# Altium project LoraNode.PrjPcb
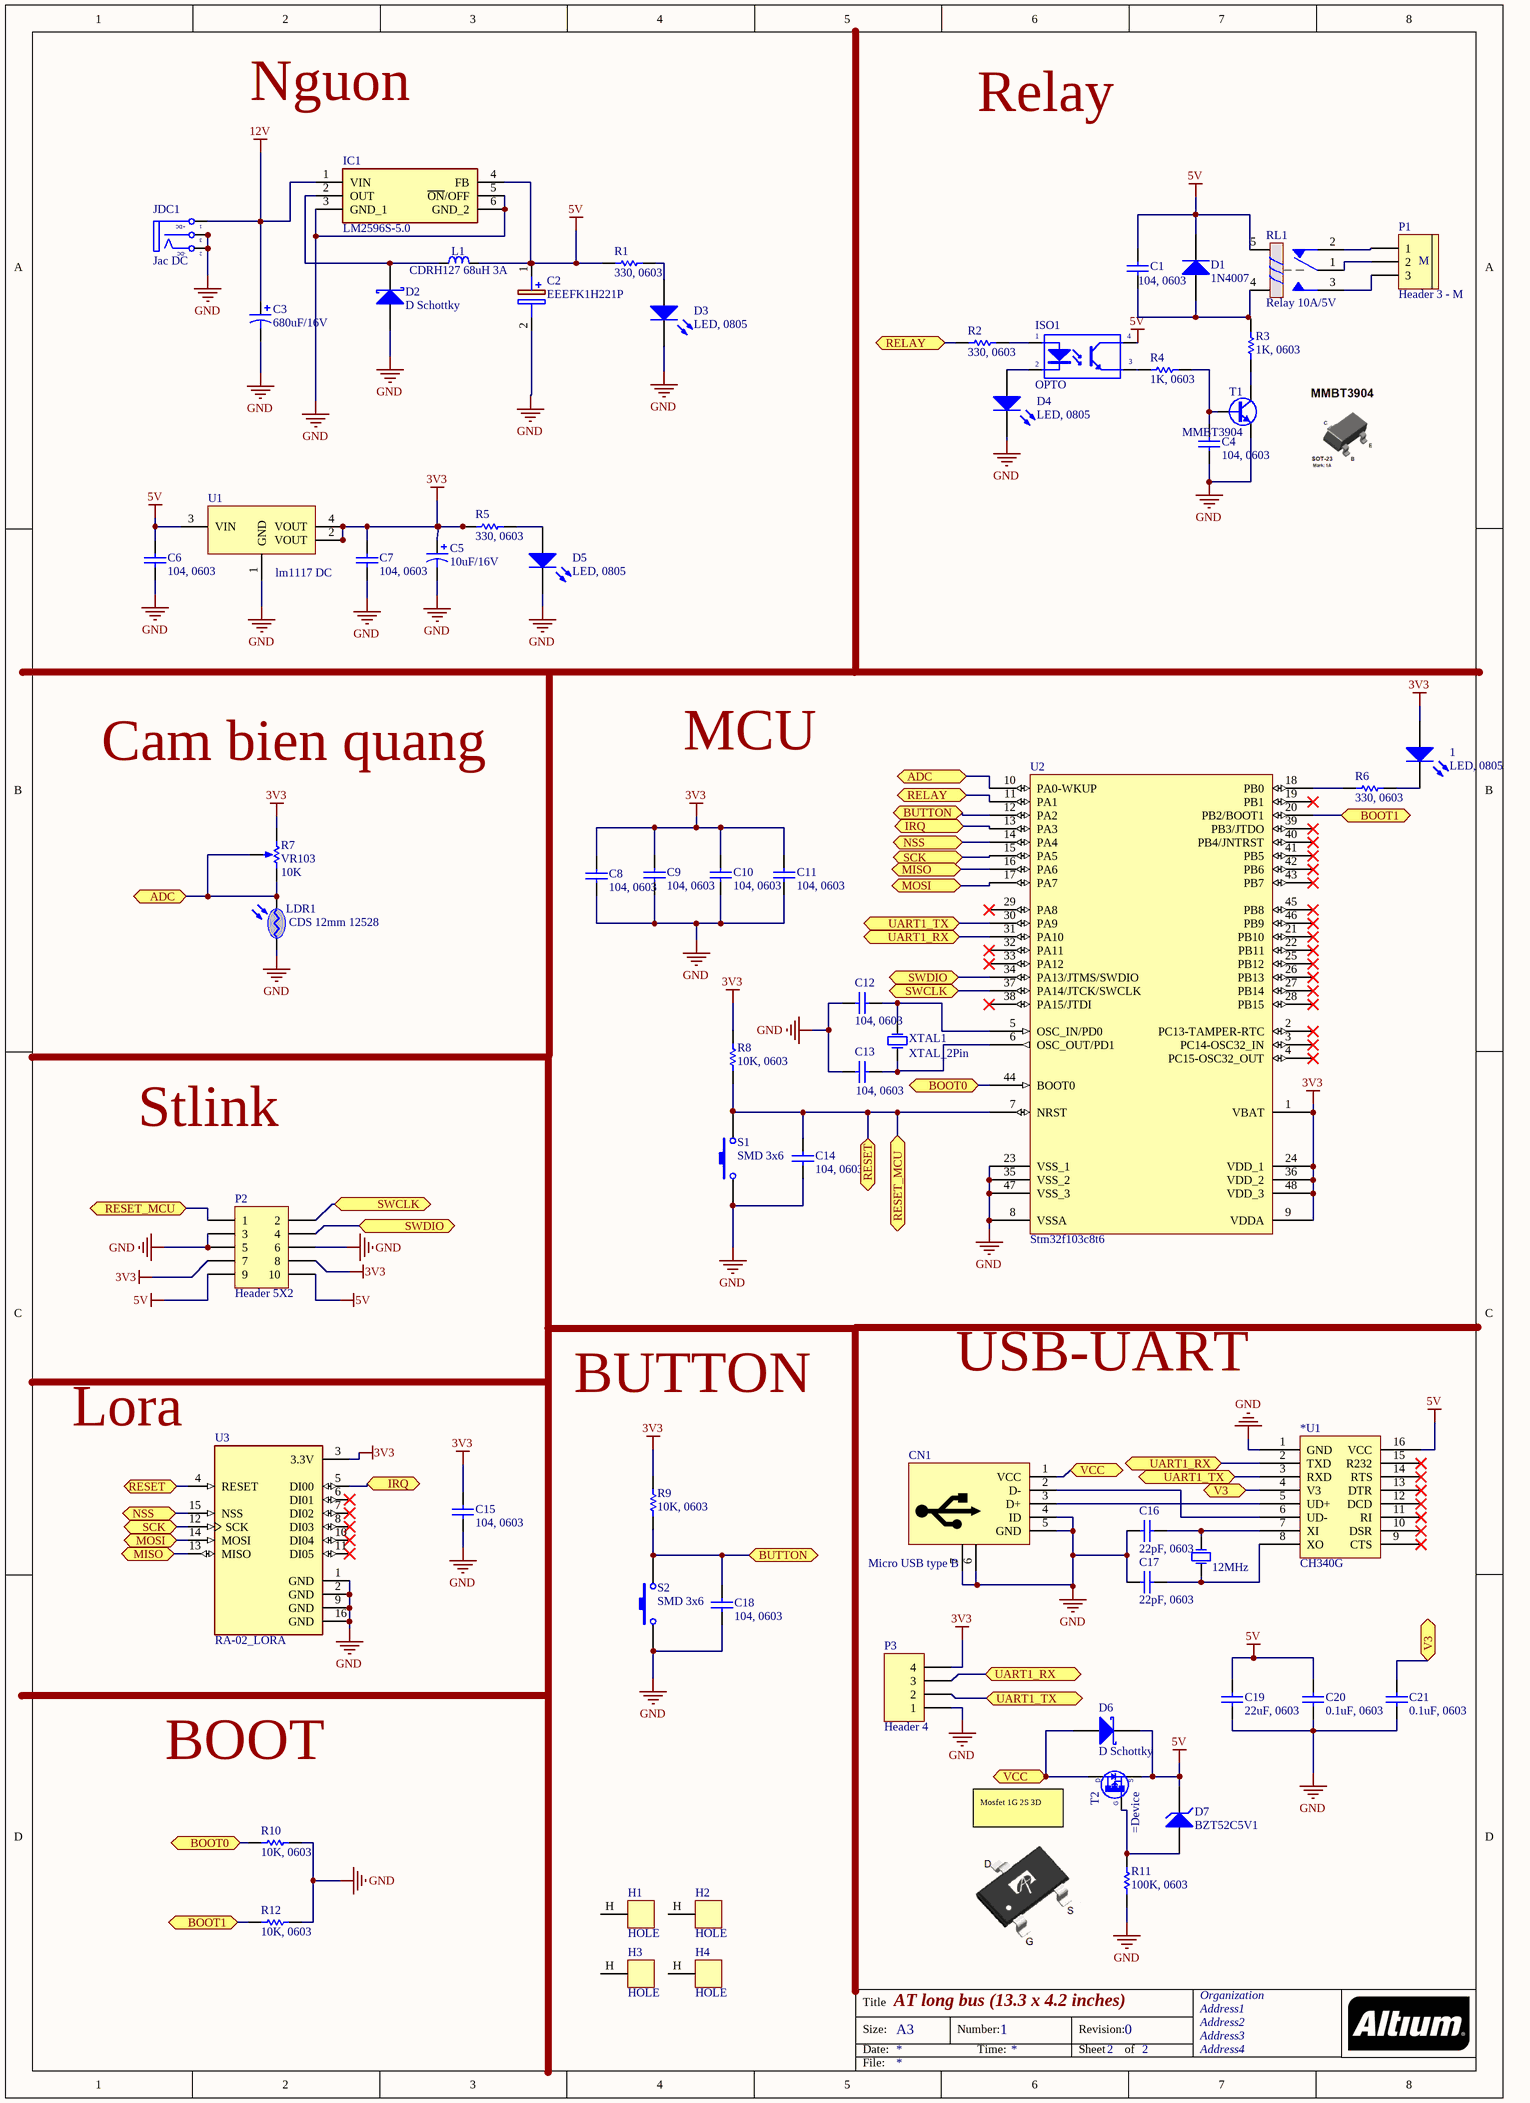
[diagram p0: LoraNode.schdoc]
1 sheet, 65 parts. Net scope: flat (ports and power ports of the same name join across sheets).
Board file: LoraNode.PcbDoc

## Sheet LoraNode.schdoc: AT long bus (13.3 x 4.2 inches)
size A3 portrait; Organization: Organization; Address1: Address1; Address2: Address2; Address3: Address3; Address4: Address4; DocumentNumber: 1; Revision: 0; SheetNumber: 2; SheetTotal: 2

### Parts
1  LED, 0805  [LED0805]
*U1  CH340G  [SOIC127P680X230-16N]
C1  value 104, 0603  [0603 CAP]  (hidden comment: Cap)
C2  EEEFK1H221P  [CAPAE1030X1080N]
C3  value 680uF/16V  [Cap SMD 10x10x10,5]  (hidden comment: Cap Pol2)
C4  value 104, 0603  [0603 CAP]  (hidden comment: Cap)
C5  value 10uF/16V  [Cap size B]  (hidden comment: Cap Pol2)
C6  value 104, 0603  [0603 CAP]  (hidden comment: Cap)
C7  value 104, 0603  [0603 CAP]  (hidden comment: Cap)
C8  value 104, 0603  [0603 CAP]  (hidden comment: Cap)
C9  value 104, 0603  [0603 CAP]  (hidden comment: Cap)
C10  value 104, 0603  [0603 CAP]  (hidden comment: Cap)
C11  value 104, 0603  [0603 CAP]  (hidden comment: Cap)
C12  value 104, 0603  [0603 CAP]  (hidden comment: Cap)
C13  value 104, 0603  [0603 CAP]  (hidden comment: Cap)
C14  value 104, 0603  [0603 CAP]  (hidden comment: Cap)
C15  value 104, 0603  [0603 CAP]  (hidden comment: Cap)
C16  value 22pF, 0603  [0603 CAP]  (hidden comment: Cap)
C17  value 22pF, 0603  [0603 CAP]  (hidden comment: Cap)
C18  value 104, 0603  [0603 CAP]  (hidden comment: Cap)
C19  value 22uF, 0603  [0603 CAP]  (hidden comment: Cap)
C20  value 0.1uF, 0603  [0603 CAP]  (hidden comment: Cap)
C21  value 0.1uF, 0603  [0603 CAP]  (hidden comment: Cap)
CN1  Micro USB type B  [USB-B-Micro-Hole]
D1  1N4007  [DO 214]
D2  D Schottky  [DO-214AC]
D3  LED, 0805  [LED0805]
D4  LED, 0805  [LED0805]
D5  LED, 0805  [LED0805]
D6  D Schottky  [DO-214AC]
D7  BZT52C5V1  [DO 214]
H1  HOLE  [HOLE]
H2  HOLE  [HOLE]
H3  HOLE  [HOLE]
H4  HOLE  [HOLE]
IC1  LM2596S-5.0  [KTT0005B]
ISO1  OPTO  [PC817 SMD]
JDC1  Jac DC  [DC-IN]
L1  CDRH127 68uH 3A  [IND_BOURNS_SRR1260]
LDR1  CDS 12mm 12528  [CDS]
P1  Header 3 - M  [Medium - Header 3]
P2  Header 5X2  [HDR2X5]
P3  Header 4  [HDR1X4]
R1  value 330, 0603  [0603 RESISTOR]  (hidden comment: Resistor)
R2  value 330, 0603  [0603 RESISTOR]  (hidden comment: Resistor)
R3  value 1K, 0603  [0603 RESISTOR]  (hidden comment: Resistor)
R4  value 1K, 0603  [0603 RESISTOR]  (hidden comment: Resistor)
R5  value 330, 0603  [0603 RESISTOR]  (hidden comment: Resistor)
R6  value 330, 0603  [0603 RESISTOR]  (hidden comment: Resistor)
R7  VR103  value 10K  [VR]
R8  value 10K, 0603  [0603 RESISTOR]  (hidden comment: Resistor)
R9  value 10K, 0603  [0603 RESISTOR]  (hidden comment: Resistor)
R10  value 10K, 0603  [0603 RESISTOR]  (hidden comment: Resistor)
R11  value 100K, 0603  [0603 RESISTOR]  (hidden comment: Resistor)
R12  value 10K, 0603  [0603 RESISTOR]  (hidden comment: Resistor)
RL1  Relay 10A/5V  [RL_SPDT_10A]
S1  SMD 3x6  [SW-SMD]
S2  SMD 3x6  [SW-SMD]
T1  MMBT3904  [SOT23 - 3PIN]
T2  (no value)  [SOT23 - 3PIN]
U1  lm1117 DC  [SOT230P700X175-4N]
U2  Stm32f103c8t6  [LQFP 48 PIN]
U3  RA-02_LORA  [MODULE_RA-02_LORA]
XTAL1  XTAL_2Pin  [XTAL_HC-49/U]
Y1  12MHz  [XTAL_CITIZEN_HCM49]

### Ports
ADC (bidir), BOOT0 (bidir), BOOT1 (bidir), BUTTON (bidir), IRQ (bidir), MISO (bidir), MOSI (bidir), NSS (bidir), RELAY (bidir), RESET (bidir), RESET_MCU (bidir), SCK (bidir), SWCLK (bidir), SWDIO (bidir), UART1_RX (bidir), UART1_TX (bidir), V3 (bidir), VCC (bidir)

### Nets
3V3: 1.1(A) C5.1 C7.2 C8.2 C9.2 C10.2 C11.2 C15.2 P2.7 P2.8 P3.4 R5.2 R7.1(TOP) R8.2 R9.2 U1.2(VOUT) U1.4(VOUT) U2.1(VBAT) U2.9(VDDA) U2.24(VDD_1) U2.36(VDD_2) U2.48(VDD_3) U3.3(3.3V)
5V: *U1.16(VCC) C1.2 C2.1(+) C6.2 C19.1 C20.1 D1.2(K) D6.2(K) D7.2(K) IC1.4(FB) ISO1.4(C) L1.2 P2.9 P2.10 R1.2 RL1.5 T2.2(S) U1.3(VIN)
12V: C3.1 IC1.1(VIN) JDC1.1(T)
GND: *U1.1(GND) C2.2(-) C3.2 C4.1 C5.2 C6.1 C7.1 C8.1 C9.1 C10.1 C11.1 C12.2 C13.2 C14.1 C15.1 C16.2 C17.2 C18.1 C19.2 C20.2 C21.2 CN1.4(ID) CN1.5(GND) CN1.6(GND) CN1.7(GND) D2.1(A) D3.2(K) D4.2(K) D5.2(K) IC1.3(GND_1) IC1.5(~{ON}/OFF) IC1.6(GND_2) JDC1.2(TN) JDC1.3(S) LDR1.1(A) P2.3 P2.5 P2.6 P3.1 R10.1 R11.2 R12.1 S1.1 S2.1 T1.2(E) U1.1(GND) U2.8(VSSA) U2.23(VSS_1) U2.35(VSS_2) U2.47(VSS_3) U3.1(GND) U3.2(GND) U3.9(GND) U3.16(GND)
Net1_2: 1.2(K) R6.2
Net*U1_2: *U1.2(TXD) P3.3 U2.31(PA10) ; port UART1_RX
Net*U1_3: *U1.3(RXD) P3.2 U2.30(PA9) ; port UART1_TX
Net*U1_4: *U1.4(V3) C21.1 ; port V3
Net*U1_5: *U1.5(UD+) CN1.3(D+)
Net*U1_6: *U1.6(UD-) CN1.2(D-)
Net*U1_7: *U1.7(XI) C16.1 Y1.2(OSC2)
Net*U1_8: *U1.8(XO) C17.1 Y1.1(OSC1)
NetC1_1: C1.1 D1.1(A) R3.1 RL1.4
NetC4_2: C4.2 R4.1 T1.1(B)
NetC12_1: C12.1 U2.5(OSC_IN/PD0) XTAL1.2(OSC2)
NetC13_1: C13.1 U2.6(OSC_OUT/PD1) XTAL1.1(OSC1)
NetC14_2: C14.2 P2.1 R8.1 S1.2 U2.7(NRST) U3.4(RESET) ; port RESET_MCU, port RESET
NetC18_2: C18.2 R9.1 S2.2 U2.12(PA2) ; port BUTTON
NetCN1_1: CN1.1(VCC) D6.1(A) T2.3(D) ; port VCC
NetD2_2: D2.2(K) IC1.2(OUT) L1.1
NetD3_1: D3.1(A) R1.1
NetD4_1: D4.1(A) ISO1.2(K)
NetD5_1: D5.1(A) R5.1
NetD7_1: D7.1(A) R11.1 T2.1(G)
NetISO1_1: ISO1.1(A) R2.1
NetISO1_3: ISO1.3(E) R4.2
NetLDR1_2: LDR1.2(K) R7.2(TAP) R7.3(BOT) U2.10(PA0-WKUP) ; port ADC
NetP1_1: P1.1 RL1.2
NetP1_2: P1.2 RL1.1
NetP1_3: P1.3 RL1.3
NetP2_2: P2.2 U2.37(PA14/JTCK/SWCLK) ; port SWCLK
NetP2_4: P2.4 U2.34(PA13/JTMS/SWDIO) ; port SWDIO
NetR2_2: R2.2 U2.11(PA1) ; port RELAY
NetR3_2: R3.2 T1.3(C)
NetR6_1: R6.1 U2.18(PB0)
NetR10_2: R10.2 U2.44(BOOT0) ; port BOOT0
NetR12_2: R12.2 U2.20(PB2/BOOT1) ; port BOOT1
NetU2_13: U2.13(PA3) U3.5(DI00) ; port IRQ
NetU2_14: U2.14(PA4) U3.15(NSS) ; port NSS
NetU2_15: U2.15(PA5) U3.12(SCK) ; port SCK
NetU2_16: U2.16(PA6) U3.13(MISO) ; port MISO
NetU2_17: U2.17(PA7) U3.14(MOSI) ; port MOSI

Not connected (* = marked no-connect by the designer): *U1 9(CTS)* 10(DSR)* 11(RI)* 12(DCD)* 13(DTR)* 14(RTS)* 15(R232)*; H1 H(HOLE); H2 H(HOLE); H3 H(HOLE); H4 H(HOLE); U2 2(PC13-TAMPER-RTC)* 3(PC14-OSC32_IN)* 4(PC15-OSC32_OUT)* 19(PB1)* 21(PB10)* 22(PB11)* 25(PB12)* 26(PB13)* 27(PB14)* 28(PB15)* 29(PA8)* 32(PA11)* 33(PA12)* 38(PA15/JTDI)* 39(PB3/JTDO)* 40(PB4/JNTRST)* 41(PB5)* 42(PB6)* 43(PB7)* 45(PB8)* 46(PB9)*; U3 6(DI01)* 7(DI02)* 8(DI03)* 10(DI04)* 11(DI05)*

### Notes on the sheet
- Nguon
- Relay
- Cam bien quang
- MCU
- Stlink
- USB-UART
- (near U3) Lora
- BUTTON
- BOOT
- (near T2) Mosfet 1G 2S 3D
- Title
- Size:
- Date:
- A3
- Number:
- Time:
- Revision:
- Sheet
- of
- File:
- (in symbol DCIN) +DC; -DC
- (in symbol Header 3 - M) M

### Library data of the parts
1 D3-D5 = LED: Typical INFRARED GaAs LED; Published: 8-Jun-2000; LatestRevisionDate: 08-Jul-2005; LatestRevisionNote: Mech Layer 1 removed.; PackageReference: LED-0; Publisher: Altium Limited
C1 C4 C6-C21 = Cap: Capacitor; Published: 8-Jun-2000; LatestRevisionDate: 17-Jul-2002; LatestRevisionNote: Re-released for DXP Platform.; PackageReference: RAD-0.3; Publisher: Altium Limited
C2 = EEEFK1H221P: Capacitor Polarised; Manufacturer_Name: Panasonic; Datasheet Link: https://industrial.panasonic.com/cdbs/www-data/pdf/RDE0000/ABA0000C1181.pdf; Height: 10.8mm; Manufacturer_Part_Number: EEEFK1H221P; Arrow Part Number: EEEFK1H221P; Arrow Price/Stock: https://www.arrow.com/en/products/eeefk1h221p/panasonic
C3 C5 = Cap Pol2: Polarized Capacitor (Axial); Published: 8-Jun-2000; LatestRevisionDate: 17-Jul-2002; LatestRevisionNote: Re-released for DXP Platform.; PackageReference: POLAR0.8; Publisher: Altium Limited
CN1 = USB_MICRO_TYPE_B
D1 = Diode: Default Diode; Published: 8-Jun-2000; LatestRevisionDate: 17-Jul-2002; LatestRevisionNote: Re-released for DXP Platform.; PackageVersion: Sep-1996; PackageReference: SMC; Publisher: Altium Limited; Code_JEDEC: DO-214-AB
D2 D6 = D Schottky: Schottky Diode; Published: 8-Jun-2000; LatestRevisionDate: 17-Jul-2002; LatestRevisionNote: Re-released for DXP Platform.; PackageReference: SMB; Publisher: Altium Limited; Code_JEDEC: DO-214-AA
D7 = Diode Zener: Zener Diode; Published: 8-Jun-2000; LatestRevisionDate: 17-Jul-2002; LatestRevisionNote: Re-released for DXP Platform.; PackageReference: DIODE-0.7; Publisher: Altium Limited
IC1 = LM2596S-5.0: Integrated Circuit; Manufacturer_Name: Texas Instruments; Datasheet Link: https://www.ti.com/lit/gpn/LM2596; Manufacturer_Part_Number: LM2596S-5.0; Mouser Part Number: 926-LM2596S-50; Mouser Price/Stock: https://www.mouser.co.uk/ProductDetail/Texas-Instruments/LM2596S-50/?qs=X1J7HmVL2ZGcOr96VNr%252B%2Fw%3D%3D; Arrow Part Number: LM2596S-5.0; Arrow Price/Stock: https://www.arrow.com/en/products/lm2596s-5.0/texas-instruments
ISO1 = OPTO: Value: TLP5211
JDC1 = DCIN: Jac DC input; Value: Jac DC
L1 = Inductor
LDR1 = LDR: Quang Tro
P1 = Header 3 - M: Header, 3-Pin, Medium; LatestRevisionDate: 17-Jul-2002; LatestRevisionNote: Re-released for DXP Platform.; Publisher: Altium Limited
P2 = Header 5X2: Header, 5-Pin, Dual row; LatestRevisionDate: 17-Jul-2002; LatestRevisionNote: Re-released for DXP Platform.; Publisher: Altium Limited
P3 = Header 4: Header, 4-Pin; LatestRevisionDate: 17-Jul-2002; LatestRevisionNote: Re-released for DXP Platform.; Publisher: Altium Limited
R1-R6 R8-R12 = Resistor: Semiconductor Resistor; Published: 8-Jun-2000; LatestRevisionDate: 17-Jul-2002; LatestRevisionNote: Re-released for DXP Platform.; PackageReference: AXIAL-0.5; Publisher: Altium Limited
R7 = RPot: Potentiometer; Sim Note: Enter the Resistance value and the set point into parameter fields.; Set Position: 0.5; Published: 8-Jun-2000; LatestRevisionDate: 17-Jul-2002; LatestRevisionNote: Re-released for DXP Platform.; PackageReference: VR5; Publisher: Altium Limited
RL1 = Relay 1: Relay SPDT,10A - 12VDC 5 Pin; Value: Relay SPDT, 10A, 12V
S1 S2 = SW-PB: Switch; Published: 24-Mar-1999; LatestRevisionDate: 17-Jul-2002; LatestRevisionNote: Re-released for DXP Platform.; PackageReference: SPST-2; Publisher: Altium Limited
T1 = NPN B1 E2 C3: NPN Transistor, 1B 2E 3C
T2 = P-MOSFET-D 1G 2S 3D: P-CHANNEL MOSFET WITH DIODE
U1 = lm1117
U3 = RA-02_LORA: Ra-02 LoRa RF M5Stack Platform Evaluation Expansion Board; MF: AI-Thinker; Package: Package; Availability: Unavailable; Value: *; MP: Ra-02 LoRa; Check_prices: https://www.snapeda.com/parts/Ra-02%20LoRa/AI-Thinker/view-part/4449259/?ref=eda; SnapEDA_Link: https://www.snapeda.com/parts/Ra-02%20LoRa/AI-Thinker/view-part/4449259/?ref=snap; Price: None
Y1 = XTAL: Crystal Oscillator; Published: 8-Jun-2000; LatestRevisionDate: 17-Jul-2002; LatestRevisionNote: Re-released for DXP Platform.; PackageReference: R38; Publisher: Altium Limited